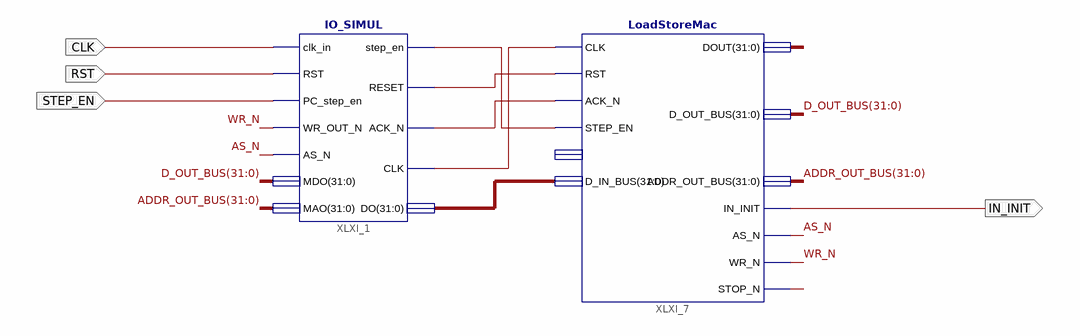
[diagram p0: schematic sheet 1]
// Xilinx ISE schematic LoadStoreMac_SIM.sch (spartan6) as structural Verilog: 2 symbols, 4 ports
module LoadStoreMac_SIM (
  input  CLK,
  input  RST,
  input  STEP_EN,
  output IN_INIT
);

  wire AS_N, WR_N, XLXN_1, XLXN_2, XLXN_3, XLXN_4, XLXN_25;
  wire [31:0] ADDR_OUT_BUS, D_OUT_BUS, XLXN_5, XLXN_18;

  IO_SIMUL XLXI_1 (
    .clk_in(CLK), .RST(RST), .PC_step_en(STEP_EN), .WR_OUT_N(WR_N), .AS_N(AS_N), .MDO(D_OUT_BUS),
    .MAO(ADDR_OUT_BUS), .step_en(XLXN_3), .RESET(XLXN_1), .ACK_N(XLXN_2), .CLK(XLXN_4), .DO(XLXN_5));
  LoadStoreMac XLXI_7 (
    .CLK(XLXN_4), .RST(XLXN_1), .ACK_N(XLXN_2), .STEP_EN(XLXN_3), .D_IN_BUS(XLXN_5), .DOUT(XLXN_18),
    .D_OUT_BUS(D_OUT_BUS), .ADDR_OUT_BUS(ADDR_OUT_BUS), .IN_INIT(IN_INIT), .AS_N(AS_N), .WR_N(WR_N),
    .STOP_N(XLXN_25));  // open: D_ADDR
endmodule
